# Altium schematic sheet RTCE.SchDoc
size A4; DocumentNumber: 30; SheetNumber: 30; SheetTotal: 30
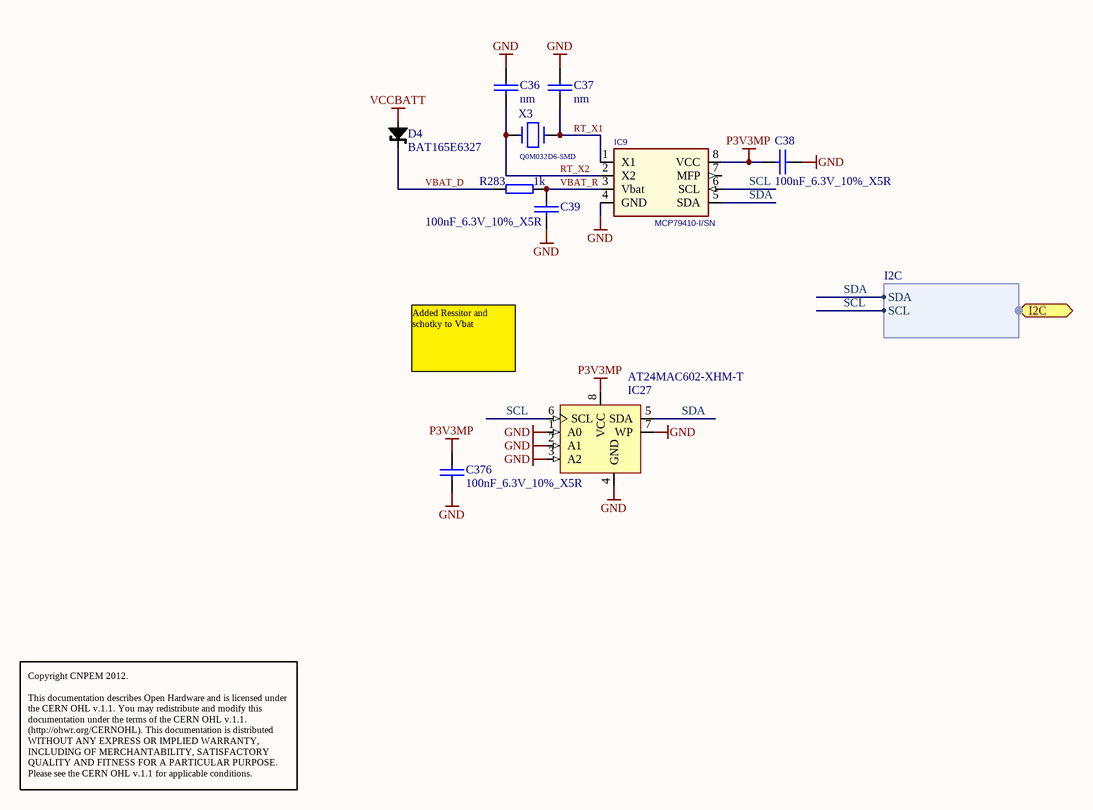
[diagram p0: RTCE.SchDoc]

## Parts
C36  nm  [0402C]
C37  nm  [0402C]
C38  100nF_6.3V_10%_X5R  [0201C]
C39  100nF_6.3V_10%_X5R  [0201C]
C376  100nF_6.3V_10%_X5R  [0201C]
D4  BAT165E6327  [SOD323]
IC9  MCP79410-I/SN  [SO-8]
IC27  AT24MAC602-XHM-T  [TSSOP-8]
R283  1k  [0402R]
X3  Q0M032D6-SMD  [crystal_85SMX]

## Ports
I2C (harness I2C)

## Harnesses
I2C: SCL, SDA

## Nets
GND: C36.1 C37.1 C38.2 C39.2 C376.2 IC9.4(GND) IC27.1(A0) IC27.2(A1) IC27.3(A2) IC27.4(GND) IC27.7(WP)
P3V3MP: C38.1 C376.1 IC9.8(VCC) IC27.8(VCC)
VCCBATT: D4.A
RT_X1: C37.2 IC9.1(X1) X3.1
RT_X2: C36.2 IC9.2(X2) X3.4
SCL: IC9.6(SCL) IC27.6(SCL) ; port I2C.SCL
SDA: IC9.5(SDA) IC27.5(SDA) ; port I2C.SDA
VBAT_D: D4.K R283.1
VBAT_R: C39.1 IC9.3(Vbat) R283.2

Not connected (* = marked no-connect by the designer): IC9 7(MFP)

## Notes on the sheet
- Added Ressitor and schotky to Vbat
- Copyright CNPEM 2012.
  This documentation describes Open Hardware and is licensed under the CERN OHL v.1.1. You may redistribute and modify this documentation under the terms of the CERN OHL v.1.1. (http://ohwr.org/CERNOHL). This documentation is distributed WITHOUT ANY EXPRESS OR IMPLIED WARRANTY, INCLUDING OF MERCHANTABILITY, SATISFACTORY QUALITY AND FITNESS FOR A PARTICULAR PURPOSE. Please see the CERN OHL v.1.1 for applicable conditions.

## Library data of the parts
C36 C37 = CAP_SMD_0402: Capacitor SMD; Supplier 1: Newark; Supplier Part Number 1: 14T3275
C38 C39 C376 = CAP_SMD_0201: Capacitor SMD
D4 = D_BAT165: 500mA, 40V, Shottky Diode
IC9 = RTC_MCP79410: RTC with 1k EEPROM and RAM; Supplier 1: Newark; Supplier Part Number 1: 76R6660
IC27 = MEM_24MAC602: Serial 2K EEPROM+ 48bit MAC
R283 = RES_0402: SMD Resistor; Supplier 1: Newark; Supplier Part Number 1: 59M6691
X3 = X_CRYSTAL_32k_SMD: Crystal oscillator 32k (Maritex); Supplier 1: Farnell; Supplier Part Number 1: 1832136